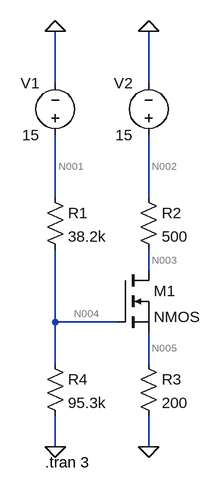
[diagram p0: schematic 2_2.asc]
2_2.asc, the LTspice schematic file:
Version 4
SHEET 1 2604 680
WIRE 32 -176 32 -256
WIRE 176 -176 176 -256
WIRE 32 0 32 -96
WIRE 176 0 176 -96
WIRE 176 112 176 80
WIRE 32 192 32 80
WIRE 128 192 32 192
WIRE 32 256 32 192
WIRE 176 256 176 208
WIRE 32 384 32 336
WIRE 176 384 176 336
FLAG 32 384 0
FLAG 176 384 0
FLAG 32 -256 0
FLAG 176 -256 0
SYMBOL res 16 -16 R0
SYMATTR InstName R1
SYMATTR Value 38.2k
SYMBOL res 160 -16 R0
SYMATTR InstName R2
SYMATTR Value 500
SYMBOL res 160 240 R0
SYMATTR InstName R3
SYMATTR Value 200
SYMBOL res 16 240 R0
SYMATTR InstName R4
SYMATTR Value 95.3k
SYMBOL voltage 32 -80 R180
WINDOW 0 24 96 Left 2
WINDOW 3 24 16 Left 2
WINDOW 123 0 0 Left 0
WINDOW 39 0 0 Left 0
SYMATTR InstName V1
SYMATTR Value 15
SYMBOL voltage 176 -80 R180
WINDOW 0 24 96 Left 2
WINDOW 3 24 16 Left 2
WINDOW 123 0 0 Left 0
WINDOW 39 0 0 Left 0
SYMATTR InstName V2
SYMATTR Value 15
SYMBOL nmos 128 112 R0
SYMATTR InstName M1
TEXT 16 408 Left 2 !.tran 3

The netlist it stands for:
* 2_2.asc
R1 N001 N004 38.2k
R2 N002 N003 500
R3 N005 0 200
R4 N004 0 95.3k
V1 N001 0 15
V2 N002 0 15
M1 N003 N004 N005 N005 NMOS
.model NMOS NMOS
.model PMOS PMOS
.lib standard.mos
.tran 3
.backanno
.end

* Results of the author's LTspice run, read from the files saved beside the schematic
* Operating Point, zero values left out:
*   V(n001) = 15 V
*   V(n004) = 10.71 V
*   V(n002) = 15 V
*   V(n003) = 14.45 V
*   V(n005) = 220 mV
*   Id(M1) = 1.1 mA
*   Ib(M1) = -14.24 pA
*   Is(M1) = -1.1 mA
*   I(R1) = 112.4 µA
*   I(R2) = 1.1 mA
*   I(R3) = 1.1 mA
*   I(R4) = 112.4 µA
*   I(V1) = -112.4 µA
*   I(V2) = -1.1 mA